# Altium project PCB_Project.PrjPcb
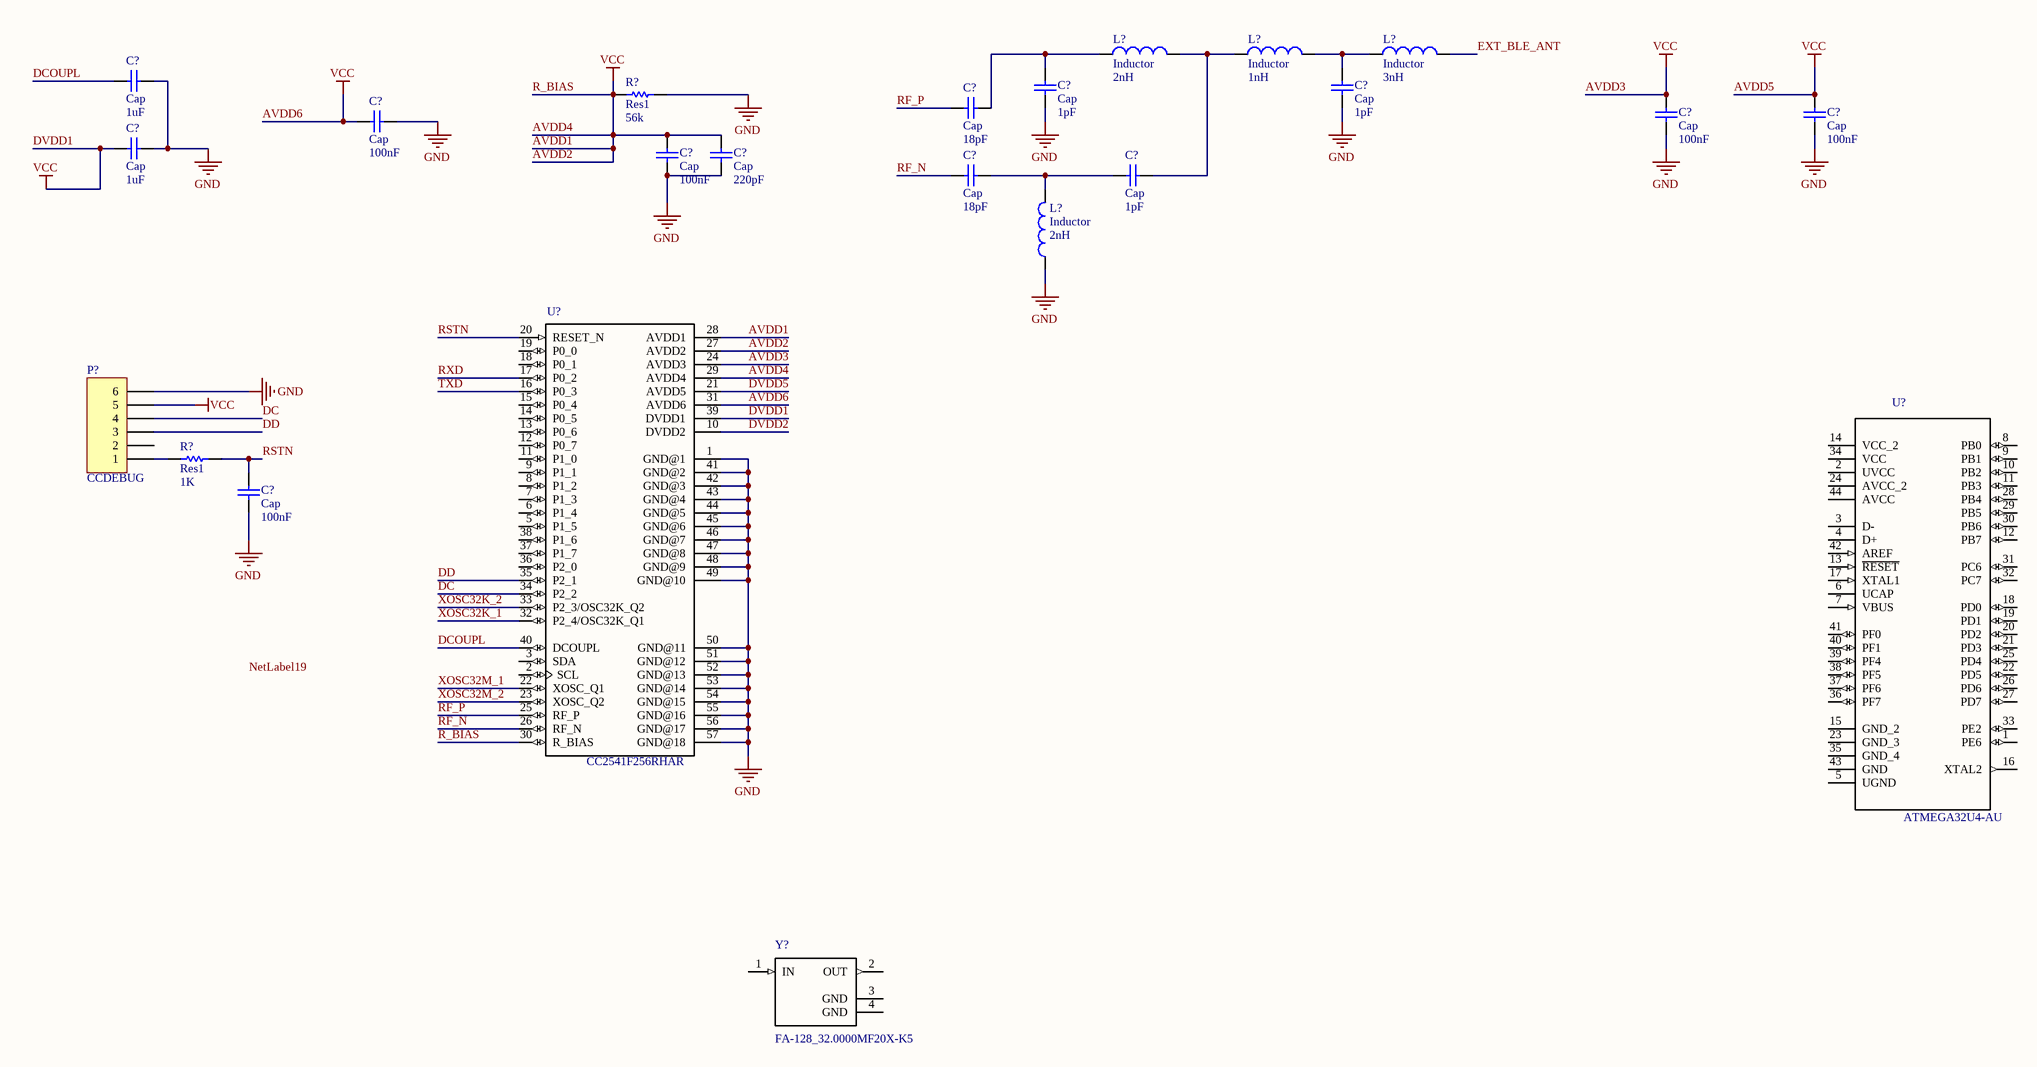
[diagram p0: main.SchDoc]
1 sheet, 23 parts. Net scope: global (net labels, ports and power ports of the same name join across sheets).

## Sheet main.SchDoc
size C; Organization: Altium Limited; Address1: L3, 12a Rodborough Rd; Address2: Frenchs Forest; Address3: NSW; Address4: Australia 2086

### Parts
(Parts that share a designator on the sheet are numbered #1, #2 ... from top to bottom, then left to right.)
C?#1  Cap  value 1pF  [RAD-0.3]
C?#2  Cap  value 1pF  [RAD-0.3]
C?#3  Cap  value 1uF  [RAD-0.3]
C?#4  Cap  value 100nF  [RAD-0.3]
C?#5  Cap  value 100nF  [RAD-0.3]
C?#6  Cap  value 18pF  [RAD-0.3]
C?#7  Cap  value 100nF  [RAD-0.3]
C?#8  Cap  value 100nF  [RAD-0.3]
C?#9  Cap  value 220pF  [RAD-0.3]
C?#10  Cap  value 1uF  [RAD-0.3]
C?#11  Cap  value 1pF  [RAD-0.3]
C?#12  Cap  value 18pF  [RAD-0.3]
C?#13  Cap  value 100nF  [RAD-0.3]
L?#1  Inductor  value 2nH  [0402-A]
L?#2  Inductor  value 1nH  [0402-A]
L?#3  Inductor  value 3nH  [0402-A]
L?#4  Inductor  value 2nH  [0402-A]
P?  CCDEBUG  [HDR1X6]
R?#1  Res1  value 56k  [AXIAL-0.3]
R?#2  Res1  value 1K  [AXIAL-0.3]
U?#1  CC2541F256RHAR  [*QFN50P600X600X100-41N]
U?#2  ATMEGA32U4-AU  [*QFP80P1200X1200X120-44N]
Y?  FA-128_32.0000MF20X-K5  [*OSCCC200X160X50N]

### Nets
AVDD1: C?#4.1 C?#5.1 C?#7.2 C?#8.1 C?#9.1 C?#10.2 P?.5 R?#1.1 U?#1.24(AVDD3) U?#1.27(AVDD2) U?#1.28(AVDD1) U?#1.29(AVDD4) U?#1.30(R_BIAS) U?#1.31(AVDD6) U?#1.39(DVDD1)  [also labelled AVDD2, AVDD3, AVDD4, AVDD5, AVDD6, DVDD1, R_BIAS, VCC]
GND: C?#1.2 C?#2.2 C?#3.1 C?#4.2 C?#5.2 C?#7.1 C?#8.2 C?#9.2 C?#10.1 C?#13.2 L?#4.1 P?.6 R?#1.2 U?#1.1(GND@1) U?#1.41(GND@2) U?#1.42(GND@3) U?#1.43(GND@4) U?#1.44(GND@5) U?#1.45(GND@6) U?#1.46(GND@7) U?#1.47(GND@8) U?#1.48(GND@9) U?#1.49(GND@10) U?#1.50(GND@11) U?#1.51(GND@12) U?#1.52(GND@13) U?#1.53(GND@14) U?#1.54(GND@15) U?#1.55(GND@16) U?#1.56(GND@17) U?#1.57(GND@18)
DC: P?.4 U?#1.34(P2_2)
DCOUPL: C?#3.2 U?#1.40(DCOUPL)
DD: P?.3 U?#1.35(P2_1)
DVDD2: U?#1.10(DVDD2)
DVDD5: U?#1.21(AVDD5)
EXT_BLE_ANT: L?#3.2
RF_N: C?#12.2 U?#1.26(RF_N)
RF_P: C?#6.2 U?#1.25(RF_P)
RSTN: C?#13.1 R?#2.2 U?#1.20(RESET_N)
RXD: U?#1.17(P0_2)
TXD: U?#1.16(P0_3)
XOSC32K_1: U?#1.32(P2_4/OSC32K_Q1)
XOSC32K_2: U?#1.33(P2_3/OSC32K_Q2)
XOSC32M_1: U?#1.22(XOSC_Q1)
XOSC32M_2: U?#1.23(XOSC_Q2)
NetC?#1_1: C?#1.1 C?#6.1 L?#1.1
NetC?#2_1: C?#2.1 L?#2.2 L?#3.1
NetC?#11_1: C?#11.1 C?#12.1 L?#4.2
NetC?#11_2: C?#11.2 L?#1.2 L?#2.1
NetP?_1: P?.1 R?#2.1

Not connected (* = marked no-connect by the designer): P? 2; U?#1 2(SCL) 3(SDA) 5(P1_5) 6(P1_4) 7(P1_3) 8(P1_2) 9(P1_1) 11(P1_0) 12(P0_7) 13(P0_6) 14(P0_5) 15(P0_4) 18(P0_1) 19(P0_0) 36(P2_0) 37(P1_7) 38(P1_6); U?#2 1(PE6) 2(UVCC) 3(D-) 4(D+) 5(UGND) 6(UCAP) 7(VBUS) 8(PB0) 9(PB1) 10(PB2) 11(PB3) 12(PB7) 13(~{RESET}) 14(VCC_2) 15(GND_2) 16(XTAL2) 17(XTAL1) 18(PD0) 19(PD1) 20(PD2) 21(PD3) 22(PD5) 23(GND_3) 24(AVCC_2) 25(PD4) 26(PD6) 27(PD7) 28(PB4) 29(PB5) 30(PB6) 31(PC6) 32(PC7) 33(PE2) 34(VCC) 35(GND_4) 36(PF7) 37(PF6) 38(PF5) 39(PF4) 40(PF1) 41(PF0) 42(AREF) 43(GND) 44(AVCC); Y? 1(IN) 2(OUT) 3(GND) 4(GND)

### Notes on the sheet
- Labels drawn without touching a wire or pin: NetLabel19
- Title
- Size:
- Date:
- File:
- C
- Number:
- Time:
- Revision:
- Sheet
- of

### Library data of the parts
C?#1-C?#13 = Cap: Capacitor; Published: 8-Jun-2000; LatestRevisionDate: 17-Jul-2002; LatestRevisionNote: Re-released for DXP Platform.; PackageReference: RAD-0.3; Publisher: Altium Limited; PackageDescription: Radial Cap, Thru-Hole; 2 Leads; 0.3 in Pin Spacing
L?#1-L?#4 = Inductor: Code_IEC: 1005; Published: 8-Jun-2000; LatestRevisionDate: 29-May-2009; LatestRevisionNote: IPC-7351 Footprint Added.; PackageReference: 0402-A; Publisher: Altium Limited; PackageDescription: Chip Inductor; Code_JEITA: 0402
P? = Header 6: Header, 6-Pin; LatestRevisionDate: 17-Jul-2002; LatestRevisionNote: Re-released for DXP Platform.; Publisher: Altium Limited
R?#1 R?#2 = Res1: Resistor; Published: 8-Jun-2000; LatestRevisionDate: 17-Jul-2002; LatestRevisionNote: Re-released for DXP Platform.; PackageReference: AXIAL-0.3; Publisher: Altium Limited; PackageDescription: Axial Device, Thru-Hole; 2 Leads; 0.3 in Pin Spacing
U?#1 = CC2541F256RHAR: SimpleLink Bluetooth Smart and Proprietary Wireless MCU 40-VQFN -40 to 85; MF: Texas Instruments; MP: CC2541F256RHAR; Availability: Unavailable; SnapEDA_Link: https://www.snapeda.com/parts/CC2541F256RHAR/Texas%20Instruments/view-part/?ref=snap; Package: VFQFN-40 Texas Instruments; Price: None; Value: *
U?#2 = ATMEGA32U4-AU: MCU 8-bit ATmega AVR RISC 32KB Flash 3.3V/5V 44-Pin TQFP; MF: Microchip; Package: TQFP-44 Microchip; Availability: Unavailable; MP: ATMEGA32U4-AU; Price: None; SnapEDA_Link: https://www.snapeda.com/parts/ATMEGA32U4-AU/Microchip/view-part/?ref=snap; Value: *
Y? = FA-128_32.0000MF20X-K5: / Crystal 32MHz Â±10ppm _Tol_ Â±20ppm _Stability_ 10pF FUND 60Ohm 4-Pin Mini-SMD /; MF: EPSON; MP: FA-128 32.0000MF20X-K5; Package: SMD-4 Epson; Digi-Key_Part_Number: SER4079CT-ND; Digi-Key_Purchase_URL: https://www.digikey.com/product-detail/en/epson/FA-128-32.0000MF20X-K5/SER4079CT-ND/5994864?utm_source=snapeda&utm_medium=aggregator&utm_campaign=symbol; SnapEDA_Link: https://www.snapeda.com/parts/FA-128%2032.0000MF20X-K5/EPSON/view-part/?ref=snap; Value: *